# EAGLE board 128x16 (EAGLE 7.4.0), part 1 of 2
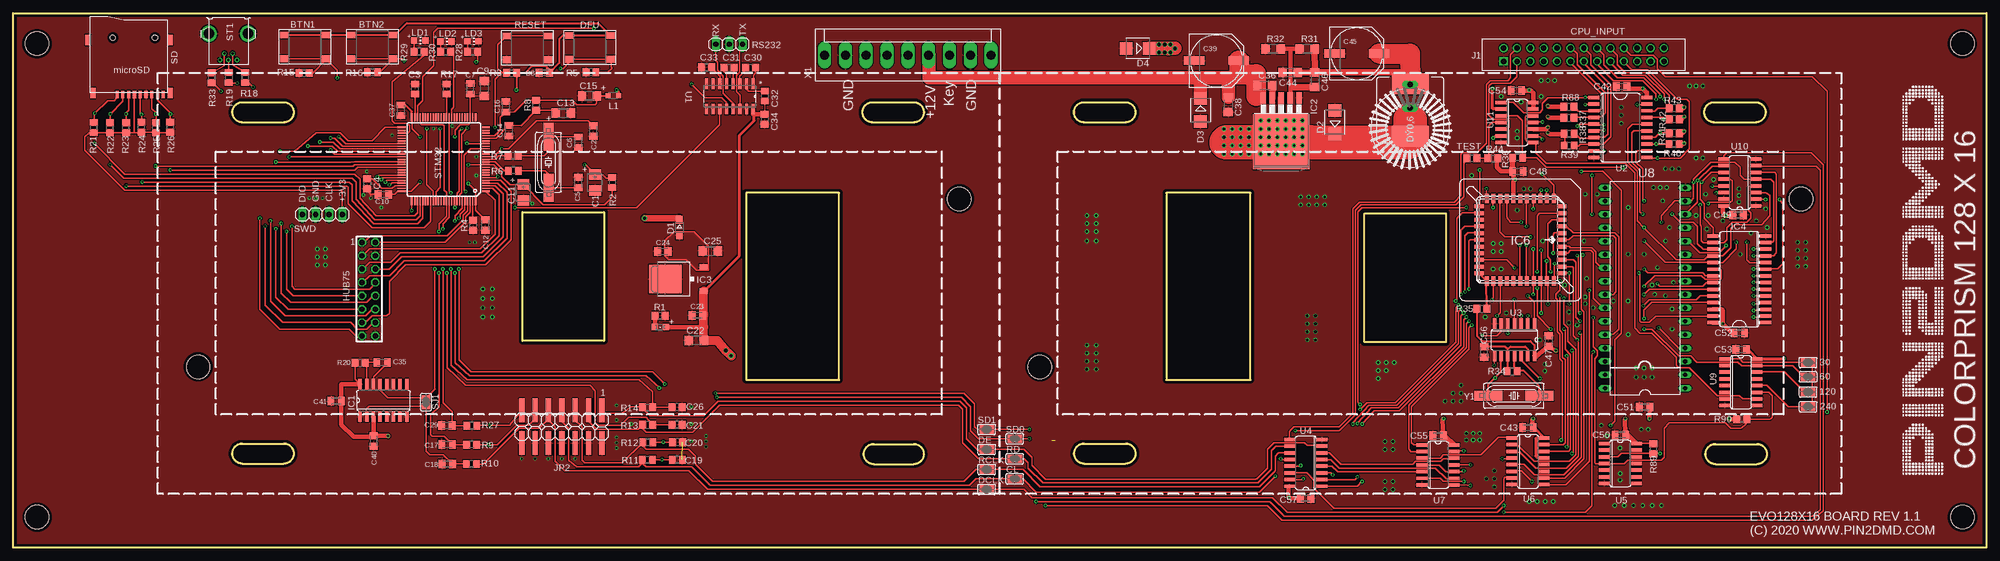
[diagram p2: board, top side]
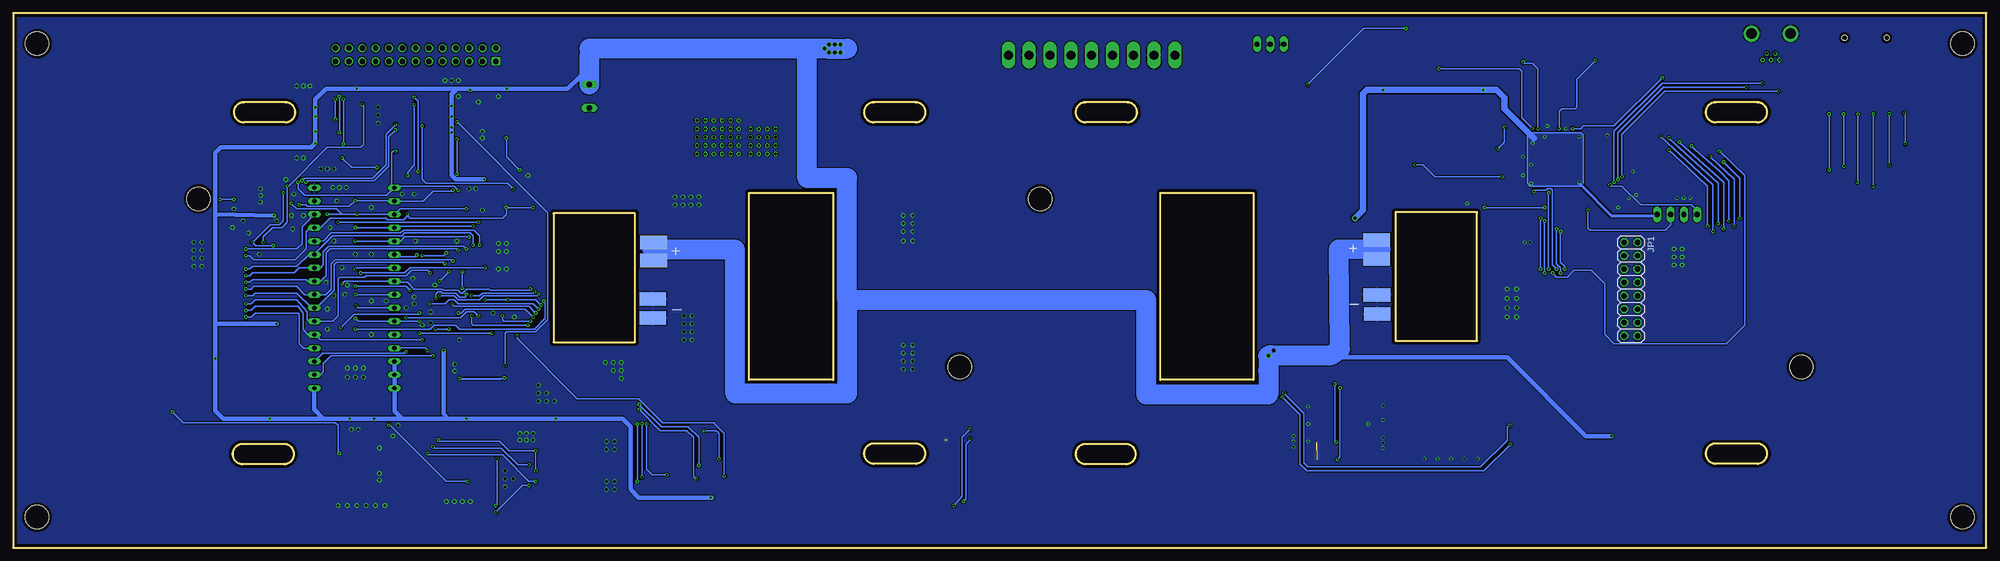
[diagram p3: board, bottom side, seen from below]

Size 375.12 x 101.59 mm. Coordinates in mm from the lower left corner, seen from the top.
Outline: 51.44,84.65 arc-180 51.44,80.84
Outline: 51.46,19.79 arc-180 51.46,15.98
Outline: 163.36,80.84 arc-180 163.36,84.65
Outline: 163.6,15.88 arc-180 163.6,19.69
Outline: 211.46,84.65 arc-180 211.46,80.84
Outline: 323.38,80.84 arc-180 323.38,84.65
Outline: 211.48,19.79 arc-180 211.48,15.98
Outline: 323.62,15.88 arc-180 323.62,19.69
Outline: 51.44,84.65 43.56,84.65 arc180 43.56,80.84 51.44,80.84
Outline: 51.44,84.65 arc-180 51.44,80.84
Outline: 51.46,19.79 43.58,19.79 arc180 43.58,15.98 51.46,15.98
Outline: 51.46,19.79 arc-180 51.46,15.98
Outline: 163.36,84.65 171.23,84.65 arc-180 171.23,80.84 163.36,80.84
Outline: 163.36,80.84 arc-180 163.36,84.65
Outline: 163.6,19.69 171.22,19.69 arc-180 171.22,15.88 163.6,15.88
Outline: 211.46,84.65 203.58,84.65 arc180 203.58,80.84 211.46,80.84
Outline: 211.46,84.65 arc-180 211.46,80.84
Outline: 323.38,84.65 331.25,84.65 arc-180 331.25,80.84 323.38,80.84
Outline: 323.38,80.84 arc-180 323.38,84.65
Outline: 211.48,19.79 203.6,19.79 arc180 203.6,15.98 211.48,15.98
Outline: 323.62,19.69 331.49,19.69 arc-180 331.49,15.88 323.62,15.88
Outline: 323.62,15.88 arc-180 323.62,19.69
Outline: 163.36,80.84 arc-180 163.36,84.65
Outline: 163.6,15.88 arc-180 163.6,19.69
Outline: 211.48,19.79 arc-180 211.48,15.98
Outline: 0,101.59 375.12,101.59 375.12,0 0,0 0,101.59
Outline: 157.03,67.44 139.36,67.44 139.36,31.88 157.03,31.88 157.03,67.44
Outline: 96.83,39.32 96.83,63.8 112.31,63.8 112.31,39.32 96.83,39.32
Outline: 235.24,67.44 219.21,67.44 219.21,31.88 235.24,31.88 235.24,67.44
Outline: 256.92,39.07 256.92,63.55 272.4,63.55 272.4,39.07 256.92,39.07
Copper layers (1*16): Top 0.035mm / dielectric 1.6mm / Bottom 0.035mm
Design rules "Elecrow_2-layer_PCB_eagle_rule *": minimum track width 6mil, minimum drill 12mil, track to track 8mil, track to pad 6mil, pad to pad 6mil, via to via 8mil, smd to smd 0mil, copper to edge 20mil, drill to drill 10mil, minimum pad ring 6mil, minimum via ring 6mil, stop-mask expansion 0mil, vias tented up to drill 100mil, thermal gap 10mil
Holes 4.5 mm at 4.53,95.79 4.57,5.82 370.59,5.82 370.58,95.79 35.18,34.34 179.87,66.28 195.2,34.34 339.89,66.28

## Footprints (pad centres in the part's own frame; a part is rotated, then mirrored left to right if it is on the bottom)
SJ = smd 1.168 x 1.6: 1 -0.762,0; 2 0.762,0
430152043826 = smd 1.55 x 1.3: 1 -3.975,2.25; 2 -3.975,-2.25; 3 3.975,2.25; 4 3.975,-2.25
CT3528 = smd 2 x 2.2: + -1.5,0; - 1.5,0
C0805K = smd 1.3 x 1.6: 1 -1,0; 2 1,0
C0805 = smd 1.3 x 1.5: 1 -0.95,0; 2 0.95,0
C1206 = smd 1.6 x 1.8: 1 -1.4,0; 2 1.4,0
PANASONIC_G = smd 3.9 x 1.6: + 4.25,0; - -4.25,0
61202622323 = drill 1.02 square: 1 -2.54,-1.27 | drill 1.02: 2 -2.54,1.27; 3 0,-1.27; 4 0,1.27; 5 2.54,-1.27; 6 2.54,1.27; 7 5.08,-1.27; 8 5.08,1.27; 9 7.62,-1.27; 10 7.62,1.27; 11 10.16,-1.27; 12 10.16,1.27; 13 12.7,-1.27; 14 12.7,1.27; 15 15.24,-1.27; 16 15.24,1.27; 17 17.78,-1.27; 18 17.78,1.27; 19 20.32,-1.27; 20 20.32,1.27; 21 22.86,-1.27; 22 22.86,1.27; 23 25.4,-1.27; 24 25.4,1.27; 25 27.94,-1.27; 26 27.94,1.27
SOD323-W = smd 1.5 x 1.2: A 1.45,0; C -1.45,0
SMB = smd 2.4 x 2.4: A 2.2,0; C -2.2,0
SO16 = smd 0.66 x 2.032: 1 -4.445,-3.073; 2 -3.175,-3.073; 3 -1.905,-3.073; 4 -0.635,-3.073; 5 0.635,-3.073; 6 1.905,-3.073; 7 3.175,-3.073; 8 4.445,-3.073; 9 4.445,3.073; 10 3.175,3.073; 11 1.905,3.073; 12 0.635,3.073; 13 -0.635,3.073; 14 -1.905,3.073; 15 -3.175,3.073; 16 -4.445,3.073
TO263-5 = smd 1.067 x 2.159: 1 -3.404,-5.791; 2 -1.702,-5.791; 3 0,-5.791; 4 1.702,-5.791; 5 3.404,-5.791 | smd 10.8 x 10.41: 6 0,2.54
TO252 = smd 1 x 1.6: 1 -2.28,-4.8; 2 2.28,-4.8 | smd 5.4 x 6.2: 3 0,2.5
SO28W = smd 0.66 x 2.032: 1 -8.255,-5.029; 2 -6.985,-5.029; 3 -5.715,-5.029; 4 -4.445,-5.029; 5 -3.175,-5.029; 6 -1.905,-5.029; 7 -0.635,-5.029; 8 0.635,-5.029; 9 1.905,-5.029; 10 3.175,-5.029; 11 4.445,-5.029; 12 5.715,-5.029; 13 6.985,-5.029; 14 8.255,-5.029; 15 8.255,5.029; 16 6.985,5.029; 17 5.715,5.029; 18 4.445,5.029; 19 3.175,5.029; 20 1.905,5.029; 21 0.635,5.029; 22 -0.635,5.029; 23 -1.905,5.029; 24 -3.175,5.029; 25 -4.445,5.029; 26 -5.715,5.029; 27 -6.985,5.029; 28 -8.255,5.029
PLCC-44 = smd 1.8 x 0.76: 1 -7.86,0; 2 -7.86,-1.27; 3 -7.86,-2.54; 4 -7.86,-3.81; 5 -7.86,-5.08; 6 -7.86,-6.35; 18 7.86,-6.35; 19 7.86,-5.08; 20 7.86,-3.81; 21 7.86,-2.54; 22 7.86,-1.27; 23 7.86,0; 24 7.86,1.27; 25 7.86,2.54; 26 7.86,3.81; 27 7.86,5.08; 28 7.86,6.35; 40 -7.86,6.35; 41 -7.86,5.08; 42 -7.86,3.81; 43 -7.86,2.54; 44 -7.86,1.27 | smd 0.76 x 1.8: 7 -6.35,-7.86; 8 -5.08,-7.86; 9 -3.81,-7.86; 10 -2.54,-7.86; 11 -1.27,-7.86; 12 0,-7.86; 13 1.27,-7.86; 14 2.54,-7.86; 15 3.81,-7.86; 16 5.08,-7.86; 17 6.35,-7.86; 29 6.35,7.86; 30 5.08,7.86; 31 3.81,7.86; 32 2.54,7.86; 33 1.27,7.86; 34 0,7.86; 35 -1.27,7.86; 36 -2.54,7.86; 37 -3.81,7.86; 38 -5.08,7.86; 39 -6.35,7.86
2X08 = drill 1.016 octagon: 1 -8.89,-1.27; 2 -8.89,1.27; 3 -6.35,-1.27; 4 -6.35,1.27; 5 -3.81,-1.27; 6 -3.81,1.27; 7 -1.27,-1.27; 8 -1.27,1.27; 9 1.27,-1.27; 10 1.27,1.27; 11 3.81,-1.27; 12 3.81,1.27; 13 6.35,-1.27; 14 6.35,1.27; 15 8.89,-1.27; 16 8.89,1.27
2X07SMD = smd 1.016 x 4.5: 1 -1.27,-4.381; 2 -1.27,1.841; 3 1.27,-4.381; 4 1.27,1.841; 5 3.81,-4.381; 6 3.81,1.841; 7 6.35,-4.381; 8 6.35,1.841; 9 8.89,-4.381; 10 8.89,1.841; 11 11.43,-4.381; 12 11.43,1.841; 13 13.97,-4.381; 14 13.97,1.841
L2012C = smd 1 x 1: 1 -1,0; 2 1,0
ED16 = drill 1.016 long: 1 -8.255,0; 2 -3.81,0
SRR1206 = smd 4 x 7: 1 -5,0; 2 5,0
CHIP-LED0805 = smd 1.2 x 1.2: A 0,-1.05; C 0,1.05
SMD2,54-5,08 = smd 2.54 x 5.08: 1 0,0
CHIPLED_0805 = smd 1.2 x 1.2: A 0,-1.05; C 0,1.05
HC49UP = smd 5.334 x 1.93: 1 -4.826,0; 2 4.826,0
R0805 = smd 1.3 x 1.5: 1 -0.95,0; 2 0.95,0
R1206 = smd 1.6 x 1.803: 1 -1.422,0; 2 1.422,0
1X03 = drill 1.016 long: 1 -2.54,0; 2 0,0; 3 2.54,0
MR**-AP*03** = smd 0.6 x 1.5: CARD_DETECTION -6.55,0.3; CLK -2.15,0.3; CMD 0.05,0.3; DAT0 -4.35,0.3; DAT1 -5.45,0.3; DAT2 2.25,0.3; DAT3/CS 1.15,0.3; GND -3.25,0.3; VCC -1.05,0.3 | smd 1 x 2: SHD_1 -7.85,0; SHD_2 6.85,0; SHD_3 -7.85,-10.1; SHD_4 7.85,-10.1 | hole 1: -4.95,-10.5; 3.05,-10.5
USBMINI = drill 0.5: 1 -1.6,3; 2 -0.8,1.8; 3 0,3; 4 0.8,1.8; 5 1.6,3 | drill 2: N1 -3.7,-2; N2 3.7,-2
LQFP100 = smd 1.5 x 0.4: 1 -8,6.075; 25 -8,-6.075; 51 8,-6.075; 75 8,6.075 | smd 1.5 x 0.25: 2 -8,5.5; 3 -8,5; 4 -8,4.5; 5 -8,4; 6 -8,3.5; 7 -8,3; 8 -8,2.5; 9 -8,2; 10 -8,1.5; 11 -8,1; 12 -8,0.5; 13 -8,0; 14 -8,-0.5; 15 -8,-1; 16 -8,-1.5; 17 -8,-2; 18 -8,-2.5; 19 -8,-3; 20 -8,-3.5; 21 -8,-4; 22 -8,-4.5; 23 -8,-5; 24 -8,-5.5; 52 8,-5.5; 53 8,-5; 54 8,-4.5; 55 8,-4; 56 8,-3.5; 57 8,-3; 58 8,-2.5; 59 8,-2; 60 8,-1.5; 61 8,-1; 62 8,-0.5; 63 8,0; 64 8,0.5; 65 8,1; 66 8,1.5; 67 8,2; 68 8,2.5; 69 8,3; 70 8,3.5; 71 8,4; 72 8,4.5; 73 8,5; 74 8,5.5 | smd 0.4 x 1.5: 26 -6.075,-8; 50 6.075,-8; 76 6.075,8; 100 -6.075,8 | smd 0.25 x 1.5: 27 -5.5,-8; 28 -5,-8; 29 -4.5,-8; 30 -4,-8; 31 -3.5,-8; 32 -3,-8; 33 -2.5,-8; 34 -2,-8; 35 -1.5,-8; 36 -1,-8; 37 -0.5,-8; 38 0,-8; 39 0.5,-8; 40 1,-8; 41 1.5,-8; 42 2,-8; 43 2.5,-8; 44 3,-8; 45 3.5,-8; 46 4,-8; 47 4.5,-8; 48 5,-8; 49 5.5,-8; 77 5.5,8; 78 5,8; 79 4.5,8; 80 4,8; 81 3.5,8; 82 3,8; 83 2.5,8; 84 2,8; 85 1.5,8; 86 1,8; 87 0.5,8; 88 0,8; 89 -0.5,8; 90 -1,8; 91 -1.5,8; 92 -2,8; 93 -2.5,8; 94 -3,8; 95 -3.5,8; 96 -4,8; 97 -4.5,8; 98 -5,8; 99 -5.5,8
1X04 = drill 1.016 long: 1 -3.81,0; 2 -1.27,0; 3 1.27,0; 4 3.81,0
SOIC127P600X175-16N = smd 2.057 x 0.61: 1 -4.801,8.89; 2 -4.801,7.62; 3 -4.801,6.35; 4 -4.801,5.08; 5 -4.801,3.81; 6 -4.801,2.54; 7 -4.801,1.27; 8 -4.801,0; 9 0,0; 10 0,1.27; 11 0,2.54; 12 0,3.81; 13 0,5.08; 14 0,6.35; 15 0,7.62; 16 0,8.89
SO20W = smd 0.66 x 2.032: 1 -5.715,-5.029; 2 -4.445,-5.029; 3 -3.175,-5.029; 4 -1.905,-5.029; 5 -0.635,-5.029; 6 0.635,-5.029; 7 1.905,-5.029; 8 3.175,-5.029; 9 4.445,-5.029; 10 5.715,-5.029; 11 5.715,5.029; 12 4.445,5.029; 13 3.175,5.029; 14 1.905,5.029; 15 0.635,5.029; 16 -0.635,5.029; 17 -1.905,5.029; 18 -3.175,5.029; 19 -4.445,5.029; 20 -5.715,5.029
SO14 = smd 0.66 x 2.032: 1 -3.81,-3.073; 2 -2.54,-3.073; 3 -1.27,-3.073; 4 0,-3.073; 5 1.27,-3.073; 6 2.54,-3.073; 7 3.81,-3.073; 8 3.81,3.073; 9 2.54,3.073; 10 1.27,3.073; 11 0,3.073; 12 -1.27,3.073; 13 -2.54,3.073; 14 -3.81,3.073
DIL32 = drill 0.813 long: 1 -19.05,-7.62; 2 -16.51,-7.62; 3 -13.97,-7.62; 4 -11.43,-7.62; 5 -8.89,-7.62; 6 -6.35,-7.62; 7 -3.81,-7.62; 8 -1.27,-7.62; 9 1.27,-7.62; 10 3.81,-7.62; 11 6.35,-7.62; 12 8.89,-7.62; 13 11.43,-7.62; 14 13.97,-7.62; 15 16.51,-7.62; 16 19.05,-7.62; 17 19.05,7.62; 18 16.51,7.62; 19 13.97,7.62; 20 11.43,7.62; 21 8.89,7.62; 22 6.35,7.62; 23 3.81,7.62; 24 1.27,7.62; 25 -1.27,7.62; 26 -3.81,7.62; 27 -6.35,7.62; 28 -8.89,7.62; 29 -11.43,7.62; 30 -13.97,7.62; 31 -16.51,7.62; 32 -19.05,7.62
KK-156-9 = drill 1.7 pad 2.184 long: 1 -15.84,0; 2 -11.88,0; 3 -7.92,0; 4 -3.96,0; 5 0,0; 6 3.96,0; 7 7.92,0; 8 11.88,0; 9 15.84,0

## Placement (x,y rotation side)
30  [SJ]  341.23,35.18 0 top
60  [SJ]  341.23,32.47 180 top
120  [SJ]  341.23,29.59 0 top
240  [SJ]  341.23,26.8 0 top
BTN1  430152043826  [430152043826]  55.47,95.19 180 top
BTN2  430152043826  [430152043826]  68.26,95.19 180 top
C1  1u  [CT3528]  110.63,69.4 270 top
C2  100n  [C0805K]  110.28,79.21 270 top
C3  2u2  [C0805]  76.39,87.18 90 top
C4  2u2  [C0805]  67.27,69.19 270 top
C5  22p  [C0805K]  107.43,69.39 90 top
C6  22p  [C0805K]  107.45,77.06 270 top
C7  100n  [C0805K]  86.89,87.23 90 top
C8  100n  [C0805K]  100.96,90.26 180 top
C9  2u2  [C1206]  89.63,87.28 90 top
C10  100n  [C0805K]  70.38,67.15 180 top
C11  2u2  [CT3528]  97.02,67.49 270 top
C12  100n  [C0805K]  89.75,61.34 270 top
C13  1u  [C1206]  104.61,82.63 0 top
C14  100n  [C0805K]  94.24,79.25 270 top
C15  1u  [C1206]  109.56,85.87 180 top
C16  100n  [C0805K]  93.69,83.79 90 top
C17  47pF  [C0805K]  82.5,19.58 0 top
C18  47pF  [C0805K]  82.53,15.92 0 top
C19  47pF  [C0805]  126.25,16.73 180 top
C20  47pF  [C0805]  126.3,20.05 180 top
C21  47pF  [C0805]  126.22,23.36 180 top
C22  2u2  [C1206]  129.89,39.38 180 top
C23  100n  [C0805K]  130.06,44.16 180 top
C24  100n  [C0805K]  123.51,56.29 180 top
C25  2u2  [C1206]  132.54,56.39 0 top
C26  47pF  [C0805]  126.23,26.66 180 top
C29  47pF  [C0805K]  82.48,23.19 0 top
C30  1u  [C0805]  140.21,91.25 0 top
C31  1u  [C0805]  136.12,91.25 0 top
C32  1u  [C0805]  142.89,85.84 270 top
C33  1u  [C0805]  131.82,91.28 0 top
C34  100n  [C0805]  142.82,81.42 270 top
C35  47p  [C0805K]  70.16,35.19 0 top
C36  1uF  [C1206]  237.96,87.87 0 top
C37  100n  [C0805K]  73.69,83.12 270 top
C38  1uF  [C1206]  231,84.19 270 top
C39  220uF/50V  [PANASONIC_G]  228.77,92.56 0 top
C40  100n  [C0805K]  68.54,20.3 270 top
C41  100n  [C0805K]  61.42,27.85 180 top
C42  100nF  [C0805K]  305.79,87.67 180 top
C43  100nF  [C0805K]  287.95,22.8 180 top
C44  1uF  [C1206]  242.78,90.27 180 top
C45  330uF/25V  [PANASONIC_G]  255.44,93.91 0 top
C46  1uF  [C1206]  247.47,88.92 270 top
C47  100nF  [C0805K]  291.89,39.26 90 top
C48  100nF  [C0805K]  286.06,71.5 0 top
C49  100nF  [C0805K]  327.94,63.23 0 top
C50  100nF  [C0805K]  305.53,21.44 180 top
C51  100nF  [C0805K]  310.16,26.71 180 top
C52  100nF  [C0805K]  328.15,40.83 0 top
C53  100nF  [C0805K]  328.48,37.67 180 top
C54  100nF  [C0805K]  285.77,86.87 180 top
C55  100nF  [C0805K]  270.89,21.28 180 top
C56  47pF  [C0805K]  279.61,37.17 270 top
C57  100nF  [C0805K]  245.72,9.38 0 top
CL  [SJ]  190.41,13.09 0 top
CPU_INPUT  J1  [61202622323]  285.89,93.68 0 top
D1  BAT60J  [SOD323-W]  126.66,60.84 270 top
D2  SK54  [SMB]  251.29,80.87 90 top
D3  SK54  [SMB]  225.72,83.19 270 top
D4  SK54  [SMB]  213.78,94.88 180 top
DCLK  [SJ]  185.08,11.06 0 top
DE  [SJ]  185.08,18.68 0 top
DFU  430152043826  [430152043826]  109.66,95.09 180 top
IC1  74LS123D  [SO16]  70.39,28 0 top
IC2  XL4015  [TO263-5]  241.06,79.71 180 top
IC3  TS 2940 CP33  [TO252]  126.46,51.05 90 top
IC4  6264  [SO28W]  328.17,51.01 90 top
IC6  [PLCC-44]  286.52,58.51 180 top
JP1  [2X08]  67.58,49.13 270 bottom
JP2  [2X07SMD]  110.66,21.72 180 top
L1  FCM1608KF-601T03  [L2012C]  114.09,85.87 180 top
L3  47uH/5A  [ED16]  265.6,79.77 270 top
L3A  [SRR1206]  265.6,83.19 90 top
LD1  red  [CHIP-LED0805]  77.3,96.37 270 top
LD2  green  [CHIP-LED0805]  82.28,96.22 270 top
LD3  blue  [CHIP-LED0805]  87.42,96.23 270 top
PAD1  [SMD2,54-5,08]  115.9,58.5 90 bottom
PAD2  [SMD2,54-5,08]  115.9,54.86 90 bottom
PAD3  [SMD2,54-5,08]  115.85,48.06 90 bottom
PAD4  [SMD2,54-5,08]  115.8,44.39 90 bottom
PAD9  [SMD2,54-5,08]  253.35,57.99 90 bottom
PAD10  [SMD2,54-5,08]  253.35,54.61 90 bottom
PAD11  [SMD2,54-5,08]  253.52,47.26 90 bottom
PAD12  [SMD2,54-5,08]  253.5,43.65 90 bottom
POWER  Power  [CHIPLED_0805]  123.05,41.92 90 top
Q1  8MHz  [HC49UP]  101.77,73.25 270 top
R1  470  [R0805]  122.98,44.05 180 top
R2  0R  [R0805]  113.89,69.39 270 top
R3  100k  [R0805]  94.74,90.24 0 top
R4  47R  [R0805]  87.44,61.25 270 top
R5  100k  [R0805]  109.84,90.35 180 top
R6  0R  [R0805]  95.1,71.67 180 top
R7  220  [R0805]  95.05,74.46 180 top
R8  47R  [R0805]  99.45,84.06 90 top
R9  220  [R0805]  87.19,19.6 180 top
R10  220  [R0805]  87.12,15.89 180 top
R11  220  [R0805]  120.56,16.73 0 top
R12  220  [R0805]  120.67,20.06 0 top
R13  220  [R0805]  120.62,23.35 0 top
R14  220  [R0805]  120.63,26.66 0 top
R15  100k  [R0805]  55.31,90.22 0 top
R16  100k  [R0805]  68.31,90.38 0 top
R17  10k  [R0805]  82.4,87.16 270 top
R18  22  [R0805]  44.09,89.37 270 top
R19  22  [R0805]  40.98,89.37 270 top
R20  1k  [R0805]  65.98,35.15 0 top
R21  10k  [R0805]  15.35,79.85 90 top
R22  10k  [R0805]  18.4,79.81 90 top
R23  10k  [R0805]  21.48,79.81 90 top
R24  10k  [R0805]  24.4,79.93 90 top
R25  10k  [R0805]  27.15,79.84 90 top
R26  10k  [R0805]  29.89,79.9 90 top
R27  220  [R0805]  87.22,23.18 180 top
R28  680  [R0805]  87.36,94.23 180 top
R29  680  [R0805]  77.21,94.25 180 top
R30  680  [R0805]  82.25,94.23 180 top
R31  11k  [R1206]  246.04,94.8 0 top
R32  3k9  [R1206]  239.52,94.8 0 top
R33  0R  [R0805]  37.72,89.33 270 top
R34  2K  [R0805]  284.97,33.53 0 top
R35  10k  [R0805]  279.2,45.42 0 top
R36  100k  [R0805]  286.03,74.14 180 top
R37  100k  [R0805]  295.76,81.72 0 top
R38  100k  [R0805]  295.78,78.69 0 top
R39  100k  [R0805]  295.8,76.43 0 top
R40  100k  [R0805]  315.74,76.72 180 top
R41  100k  [R0805]  315.78,78.77 180 top
R42  100k  [R0805]  315.78,81.43 180 top
R43  100k  [R0805]  315.78,83.51 180 top
R44  10k  [R0805]  281.3,74 0 top
R88  100k  [R0805]  295.75,83.8 0 top
R89  15K  [R0805]  311.84,18.78 90 top
R90  4.7K  [R0805]  328.64,24.43 180 top
RCLK  [SJ]  185.08,14.87 0 top
RD  [SJ]  190.41,16.9 0 top
RESET  430152043826  [430152043826]  97.78,95 0 top
RS232  [1X03]  136.12,95.68 180 top
SD  [MR**-AP*03**]  22.01,86.42 180 top
SD0  [SJ]  190.41,20.71 0 top
SD1  [SJ]  185.08,22.49 0 top
SJ1  [SJ]  78.48,27.65 270 top
ST1  Mini-USB  [USBMINI]  40.94,95.69 180 top
STM32  STM32F427VIT6  [LQFP100]  81.87,73.8 180 top
SWD  [1X04]  58.78,63.34 180 top
TEST  [R0805]  277.29,73.98 180 top
U1  MAX232D  [SOIC127P600X175-16N]  131.8,83.38 270 top
U2  74HC374DW  [SO20W]  305.55,79.87 270 top
U3  74HC04D  [SO14]  285.41,39.51 180 top
U4  74HC259D  [SO16]  245.75,16.12 90 top
U5  7407D  [SO14]  305.53,15.99 270 top
U6  74HC139D  [SO16]  287.96,16.41 270 top
U7  74HC00D  [SO14]  270.89,15.73 270 top
U8  27010 / 27512  [DIL32]  310.25,49.37 90 top
U9  4020D  [SO16]  328.44,31.44 270 top
U10  74HC153D  [SO16]  328.25,69.42 90 top
U11  74HC74D  [SO14]  285.89,80.81 270 top
X1  [KK-156-9]  170.09,93.61 0 top
Y1  8Mhz  [HC49UP]  285.32,28.88 0 top